# EAGLE design Main_v3 (EAGLE 9.5.2)
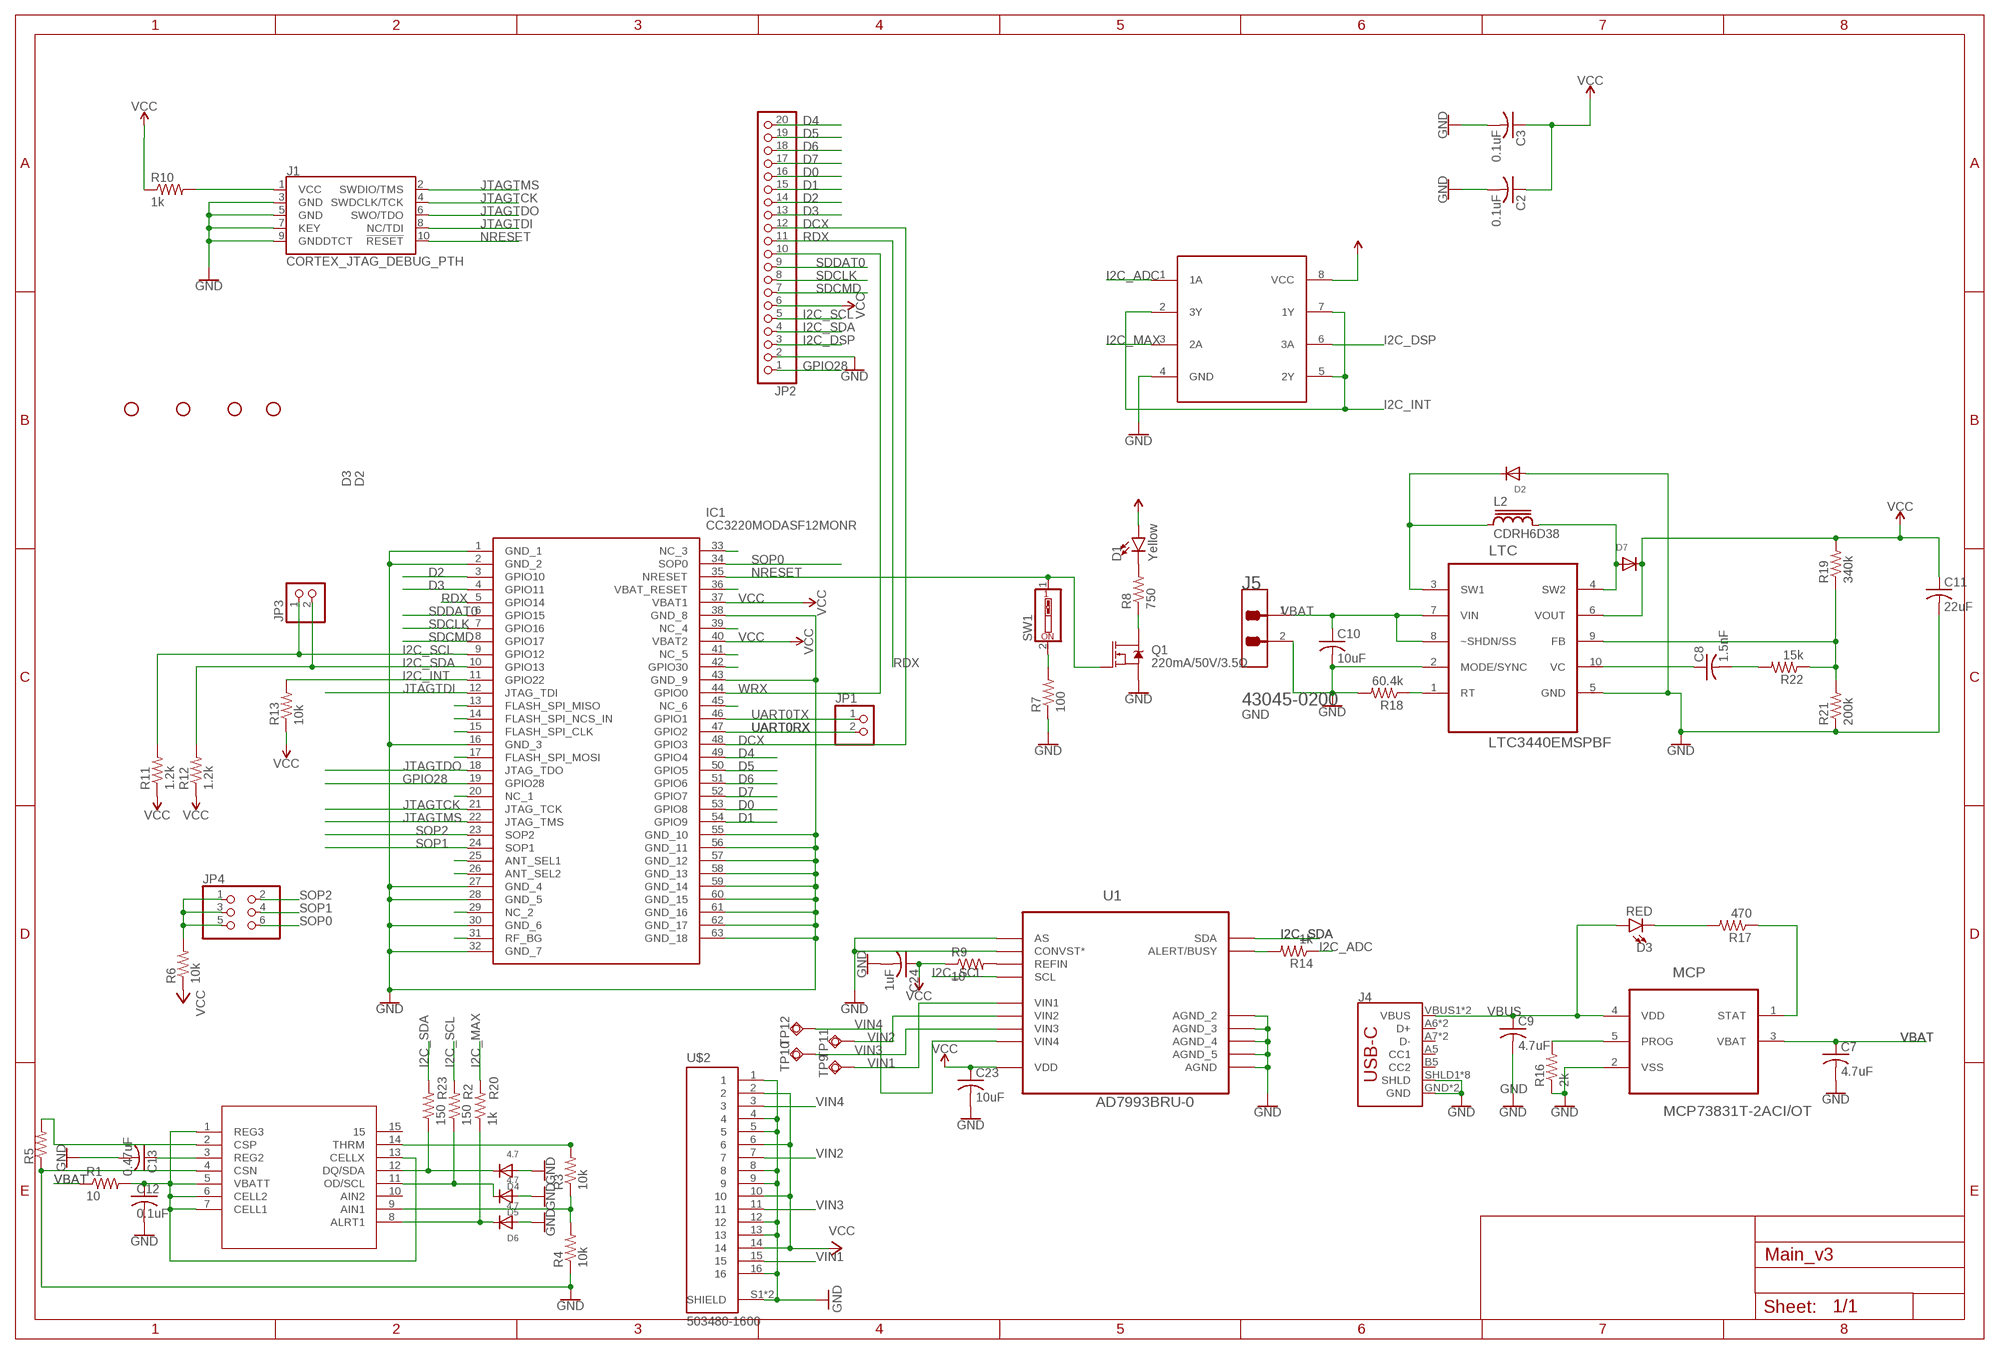
[diagram p0: schematic, sheet 1]

## Parts
74LVC  SOP65P400X110-8N  [SOP65P400X110-8N]
C2  0.1uF  C-USC0805  [C0805]
C3  0.1uF  C-USC0805  [C0805]
C7  4.7uF  C-USC0805  [C0805]
C8  1.5nF  C-USC0805  [C0805]
C9  4.7uF  C-USC0805  [C0805]
C10  10uF  C-USC0805  [C0805]
C11  22uF  C-USC1210  [C1210]
C12  0.1uF  C-USC0805  [C0805]
C13  0.47uF  C-USC0805  [C0805]
C23  10uF  C-USC0805  [C0805]
C24  1uF  C-USC0805  [C0805]
D1  Yellow  LED-YELLOW0603  [LED-0603]
D2  DIODESOD-323F  [SOD-323F]
D3  RED  LED-RED0603  [LED-0603]
D4  4.7  DIODESOD-323F  [SOD-323F]
D5  4.7  DIODESOD-323F  [SOD-323F]
D6  4.7  DIODESOD-323F  [SOD-323F]
D7  DIODESOD-323F  [SOD-323F]
H1  STAND-OFF  [STAND-OFF]
H2  STAND-OFF  [STAND-OFF]
H3  STAND-OFF  [STAND-OFF]
H4  STAND-OFF  [STAND-OFF]
IC1  CC3220MODASF12MONR  [CC3220MODASM2MONR]
J1  CORTEX_JTAG_DEBUG_PTH  [2X5-PTH-1.27MM]
J4  USB_C2-LAYER  [USB-C-16P]
J5  MOLEX_43045-0200MOLEX_43045-0200_0_0  [MOLEX_43045-0200_0]
JP1  PINHD-1X2  [1X02]
JP2  PINHD-1X20  [1X20]
JP3  PINHD-1X2  [1X02]
JP4  PINHD-2X3  [2X03]
L2  CDRH6D38  [CDRH6D]
LTC  LTC3440EMSPBF  [SOP50P490X110-10N]
MAX  MAX17201G+T  [21-0137I_T1433-1]
MCP  MCP73831T-2ACI/OT  [SOT95P280X145-5N]
Q1  220mA/50V/3.5Ω  MOSFET-NCH-BSS138  [SOT23-3]
R1  10  R-US_R0805  [R0805]
R2  150  R-US_R0805  [R0805]
R3  10k  R-US_R0805  [R0805]
R4  10k  R-US_R0805  [R0805]
R5  R-US_R0805  [R0805]
R6  10k  R-US_R0805  [R0805]
R7  100  R-US_R0805  [R0805]
R8  750  R-US_R0805  [R0805]
R9  10  R-US_R0805  [R0805]
R10  1k  R-US_R0805  [R0805]
R11  1.2k  R-US_R0805  [R0805]
R12  1.2k  R-US_R0805  [R0805]
R13  10k  R-US_R0805  [R0805]
R14  1k  R-US_R0805  [R0805]
R16  2k  R-US_R0805  [R0805]
R17  470  R-US_R0805  [R0805]
R18  60.4k  R-US_R0805  [R0805]
R19  340k  R-US_R0805  [R0805]
R20  1k  R-US_R0805  [R0805]
R21  200k  R-US_R0805  [R0805]
R22  15k  R-US_R0805  [R0805]
R23  150  R-US_R0805  [R0805]
SW1  SW_DIP-1  [EDG-01]
TP9  TPSQTP12R  [TP12R]
TP10  TPSQTP12R  [TP12R]
TP11  TPSQTP12R  [TP12R]
TP12  TPSQTP12R  [TP12R]
U1  AD7993BRU-0  [SOP65P640X120-16N]
U$2  503480-1600  [MOLEX_503480-1600]

## Nets
D0: IC1.53(GPIO8) JP2.16
D1: IC1.54(GPIO9) JP2.15
D2: IC1.3(GPIO10) JP2.14
D3: IC1.4(GPIO11) JP2.13
D4: IC1.49(GPIO4) JP2.20
D5: IC1.50(GPIO5) JP2.19
D6: IC1.51(GPIO6) JP2.18
D7: IC1.52(GPIO7) JP2.17
DCX: IC1.48(GPIO3) JP2.12
GND: 74LVC.4(GND) C2.2 C3.2 C7.2 C9.2 C10.2 C11.2 C12.2 C13.2 C23.2 C24.2 D2.A D4.A D5.A D6.A IC1.1(GND_1) IC1.2(GND_2) IC1.16(GND_3) IC1.27(GND_4) IC1.28(GND_5) IC1.30(GND_6) IC1.32(GND_7) IC1.38(GND_8) IC1.43(GND_9) IC1.55(GND_10) IC1.56(GND_11) IC1.57(GND_12) IC1.58(GND_13) IC1.59(GND_14) IC1.60(GND_15) IC1.61(GND_16) IC1.62(GND_17) IC1.63(GND_18) J1.3(GND) J1.5(GND) J1.7(KEY) J1.9(GNDDTCT) J4.GND J4.GND2(GND) J4.SHLD1(SHLD) J4.SHLD2(SHLD) J4.SHLD3(SHLD) J4.SHLD4(SHLD) J4.SHLD5(SHLD) J4.SHLD6(SHLD) J4.SHLD7(SHLD) J4.SHLD8(SHLD) J5.2 JP2.2 LTC.2(MODE/SYNC) LTC.5(GND) MAX.4(CSN) MCP.2(VSS) Q1.2(S) R4.1 R5.1 R7.1 R16.1 R18.2 R21.1 U1.1(AGND_2) U1.2(AGND_3) U1.3(AGND_4) U1.4(AGND_5) U1.11(AS) U1.12(CONVST*) U1.16(AGND) U$2.1 U$2.4 U$2.5 U$2.8 U$2.9 U$2.12 U$2.13 U$2.16 U$2.S1(SHIELD) U$2.S2(SHIELD)
GPIO28: IC1.19(GPIO28) JP2.1
I2C_ADC: 74LVC.1(1A) R14.1
I2C_DSP: 74LVC.6(3A) JP2.3
I2C_INT: 74LVC.2(3Y) 74LVC.5(2Y) 74LVC.7(1Y) IC1.11(GPIO22) R13.2
I2C_MAX: 74LVC.3(2A) R20.2
I2C_SCL: IC1.9(GPIO12) JP2.5 JP3.1 R2.2 R11.2 U1.15(SCL)
I2C_SDA: IC1.10(GPIO13) JP2.4 JP3.2 R12.2 R23.2 U1.14(SDA)
JTAG_R: J1.1(VCC) R10.2
JTAGTCK: IC1.21(JTAG_TCK) J1.4(SWDCLK/TCK)
JTAGTDI: IC1.12(JTAG_TDI) J1.8(NC/TDI)
JTAGTDO: IC1.18(JTAG_TDO) J1.6(SWO/TDO)
JTAGTMS: IC1.22(JTAG_TMS) J1.2(SWDIO/TMS)
LTC_CRS: C8.2 R22.2
LTC_FB: LTC.9(FB) R19.1 R21.2 R22.1
LTC_IND1: D2.C L2.1 LTC.3(SW1)
LTC_IND2: D7.A L2.2 LTC.4(SW2)
LTC_RT: LTC.1(RT) R18.1
LTC_VC: C8.1 LTC.10(VC)
MAX_AIN1: MAX.9(AIN1) R3.1 R4.2
MAX_CSP: MAX.2(CSP) R5.2
MAX_INT: D6.C MAX.8(ALRT1) R20.1
MAX_REG2: C13.1 MAX.3(REG2)
MAX_SCL: D5.C MAX.11(OD/SCL) R2.1
MAX_SDA: D4.C MAX.12(DQ/SDA) R23.1
MAX_THRM: MAX.14(THRM) R3.2
MAX_VBAT: C12.1 MAX.1(REG3) MAX.5(VBATT) MAX.6(CELL2) MAX.7(CELL1) MAX.13(CELLX) R1.2
MPC_LED: D3.C R17.2
MPC_RPROG: MCP.5(PROG) R16.2
MPC_STAT: MCP.1(STAT) R17.1
N$1: JP4.1 JP4.3 JP4.5 R6.2
N$2: R9.2 U1.6(REFIN)
N$3: IC1.41(NC_5)
N$4: R14.2 U1.13(ALERT/BUSY)
N$5: IC1.42(GPIO30)
N$6: IC1.39(NC_4)
N$7: IC1.36(VBAT_RESET)
N$8: IC1.33(NC_3)
N$9: IC1.45(NC_6)
N$10: IC1.25(ANT_SEL1)
N$11: IC1.26(ANT_SEL2)
N$12: IC1.29(NC_2)
N$13: IC1.31(RF_BG)
N$14: IC1.17(FLASH_SPI_MOSI)
N$15: IC1.15(FLASH_SPI_CLK)
N$16: IC1.14(FLASH_SPI_NCS_IN)
N$17: IC1.13(FLASH_SPI_MISO)
N$18: IC1.20(NC_1)
NRESET: IC1.35(NRESET) J1.10(!RESET) Q1.1(G) SW1.1
RDX: IC1.5(GPIO14) JP2.11
RESET_DIODE: D1.C R8.2
RESET_MOS: Q1.3(D) R8.1
RESET_SW1: R7.2 SW1.2
SDCLK: IC1.7(GPIO16) JP2.8
SDCMD: IC1.8(GPIO17) JP2.7
SDDAT0: IC1.6(GPIO15) JP2.9
SOP0: IC1.34(SOP0) JP4.6
SOP1: IC1.24(SOP1) JP4.4
SOP2: IC1.23(SOP2) JP4.2
UART0RX: IC1.47(GPIO2) JP1.2
UART0TX: IC1.46(GPIO1) JP1.1
VBAT: C7.1 C10.1 J5.1 LTC.7(VIN) LTC.8(~SHDN/SS) MCP.3(VBAT) R1.1
VBUS: C9.1 D3.A J4.VBUS1(VBUS) J4.VBUS2(VBUS) MCP.4(VDD)
VCC: 74LVC.8(VCC) C2.1 C3.1 C11.1 C23.1 C24.1 D1.A D7.C IC1.37(VBAT1) IC1.40(VBAT2) JP2.6 LTC.6(VOUT) R6.1 R9.1 R10.1 R11.1 R12.1 R13.1 R19.2 U1.5(VDD) U$2.2 U$2.6 U$2.10 U$2.14
VIN1: TP9.TP U1.7(VIN1) U$2.15
VIN2: TP11.TP U1.10(VIN2) U$2.7
VIN3: TP10.TP U1.8(VIN3) U$2.11
VIN4: TP12.TP U1.9(VIN4) U$2.3
WRX: IC1.44(GPIO0) JP2.10
Unconnected: J4.A5(CC1) J4.A6(D+) J4.A7(D-) J4.B5(CC2) J4.B6(D+) J4.B7(D-) MAX.10(AIN2) MAX.15

## Library data of the parts
74LVC = SOP65P400X110-8N:SOP65P400X110-8N
C2 C3 = rcl:C-US: CAPACITOR, American symbol; SPICEPREFIX: C
C7-C13 C23 C24 = adafruit:C-US: CAPACITOR, American symbol
D1 = SparkFun-LED:LED-YELLOW: Yellow SMD LED Used in manufacturing several products at SparkFun. Packages: 0603 - SMD 0603 package[Product Link] <http://www.kingbrightusa.com/product.asp?catalog_name=LED&product_id=APT1608SYCK> 0603 -SMART - SMART SMD 0603 package (more efficient/more expensive) [Product Link] <http://www.osram-os.com/osram_os/en/products/product-catalog/led-light-emitting-diodes/smartled-0603/ly-l29k/index.jsp> LilyPad - SMD1206 package[Product Datasheet] <https://www.sparkfun.com/datasheets/DevTools/LilyPad/Q150YUS4.pdf> SparkFun Products: Blynk Board <https://www.sparkfun.com/products/13794> IOIO-OTG <https://www.sparkfun.com/products/13613> XBee Explorer Serial <https://www.sparkfun.com/products/13225>; PROD_ID: DIO-09003
D2 D4-D7 = adafruit:DIODE: Diode SMADIODE - SMA Surface Mount Package 20V 1A Schottky Diode Digikey: 641-1014-6-ND DO-1N4148 - Through Hole Small Current Diode SOD-123 20V 1 A (.5mV Vf) Schottky Diode - Digikey: MBRX120TPMSCT-ND SOD-323 10V 570mA (.38mV Vf, 3ns) Schottky Diode - Digikey: ZLLS410CT-ND SOD-523 30V 30mA Schottky Diode (RB751S-40TE61) - Digikey: RB751S-40TE61CT-ND SOT23-R/W - SOT23 Package (R = Solder Paste/Reflow Ovens, W = Hand-Soldering) BAT54Film 40V 300mA - Digikey: 497-7162-1-ND
D3 = SparkFun-LED:LED-RED: Red SMD LED Used in manufacturing of most products at SparkFun Packages: 0603 - SMD 0603 package [Product Link] <http://docs.avagotech.com/docs/AV02-0551EN> 0603 SMART - SMD 0603 SMART package ( more efficient and expensive)[Product Link] <http://www.osram-os.com/Graphics/XPic2/00077099_0.pdf> 1206 - SMD1206 package [Product Link] <https://www.sparkfun.com/datasheets/DevTools/LilyPad/Q150OVS4.pdff> SparkFun Products: Pro Mini 328 -5V <https://www.sparkfun.com/products/821> RedBoard <https://www.sparkfun.com/products/12757> IOIO-OTG <https://www.sparkfun.com/products/13613>; PROD_ID: DIO-00819
H1-H4 = SparkFun-Hardware:STAND-OFF: Stand Off Drill holes for mechanically mounting via screws, standoffs, etc. Note: Use the keepout ring to avoid running the screw head into surrounding components. Variant Overviews STAND-OFF - Mechanical footprint for a #4 phillips button head screw. STAND-OFF-TIGHT - Mechanical footprint for a #4 phillips button head screw, Example SparkFun Products Screw - Phillips Head (1/4", 4-40, 10 pack) (PRT-10453) Screw - Phillips Head (1/2", 4-40, 10 pack) (PRT-10452) Screw - Phillips Head (3/4", 4-40, 10 pack) (PRT-10451) Screw - Phillips Head (1", 4-40, 10 pack) (PRT-10450)
IC1 = CC3220MODASF12MONR:CC3220MODASF12MONR: SimpleLink Wi-Fi CERTIFIED Wireless Module Solutions With Antenna Source: Datasheet; DESCRIPTION: SimpleLink Wi-Fi CERTIFIED Wireless Module Solutions With Antenna; HEIGHT: mm; MANUFACTURER_NAME: Texas Instruments; MANUFACTURER_PART_NUMBER: CC3220MODASF12MONR; MOUSER_PART_NUMBER: 595-3220MODASF12MONR; MOUSER_PRICE-STOCK: https://www.mouser.com/Search/Refine.aspx?Keyword=595-3220MODASF12MONR
J1 = SparkFun-Connectors:CORTEX_JTAG_DEBUG: Cortex Debug Connector - 10 pin Supports JTAG debug, Serial Wire debug, and Serial Wire Viewer. PTH and SMD connector options available. General Connector Information <http://infocenter.arm.com/help/topic/com.arm.doc.faqs/attached/13634/cortex_debug_connectors.pdf> Products: PTH Connector <http://www.digikey.com/product-detail/en/cnc-tech/3220-10-0100-00/1175-1627-ND/3883661> -via Digi-Key SparkFun PSoc <https://www.sparkfun.com/products/13229> SparkFun T <https://www.sparkfun.com/products/13810>
J4 = SparkFun-Connectors:USB_C: USB Type C 16Pin Connector Super Speed pins not available on the 16-pin purely SMD connector so this part is best for USB 2.0 implementations. D1 and D2 are tied together enabling D+/- no matter which way the cable is plugged into the connector. The two channel configuration pins (CC1/2) are exposed. These are normally connected to ground via 5.1k resistors but can be reconfigured for high current/high power applications.; PROD_ID: CONN-14122
J5 = Molex - 43045-0200:MOLEX_43045-0200: Wire-To-Board Connector, Micro-Fit 3.0, 43045 Series, Through Hole, Header, 2 Contacts, 3 mm; CENTROID_NOT_SPECIFIED: No; CONN_GENDER: Male; CONN_ORIENTATION: Right Angle; CONTACT_MATERIAL: Tin; CURRENT_RATING: 8.5A; DATASHEET: http://www.molex.com/webdocs/datasheets/pdf/en-us//0430450200_PCB_HEADERS.pdf; DEVICE_CLASS_L1: Connectors; DEVICE_CLASS_L2: Board to Board Connectors; DEVICE_CLASS_L3: unset; DIGIKEY_DESCRIPTION: CONN HEADER 2POS 3MM RT ANG TIN; DIGIKEY_PART_NUMBER: WM1813-ND; FOOTPRINT_URL: http://www.molex.com/pdm_docs/sd/430450200_sd.pdf; HEIGHT: 9.27mm; LEAD_FREE: yes; MF: Molex; MFG_PACKAGE_IDENT: 43045-0200; MFG_PACKAGE_IDENT_DATE: 0; MFG_PACKAGE_IDENT_REV: 0; MOUSER_DESCRIPTION: Header; Micro-Fit 3.0; SMC; 2-Row; Rt Angle; Peg Lock; 2 Cir; Tin Plate; Glow Wire Comp.; MOUSER_PART_NUMBER: 538-43045-0200; MPN: 43045-0200; NUMBER_OF_CONTACTS: 2; NUMBER_OF_ROWS: 2; PACKAGE: HDR2; PREFIX: J; ROHS: yes; TEMPERATURE_RANGE_HIGH: +105°C; TEMPERATURE_RANGE_LOW: -40°C; VERIFICATION_VERSION: 0.0.0.1; VOLTAGE_RATING: 600V
JP1 JP3 = pinhead:PINHD-1X2: PIN HEADER
JP2 = adafruit:PINHD-1X20: PIN HEADER
JP4 = pinhead:PINHD-2X3: PIN HEADER
L2 = CDRH6D38:CDRH6D38: Power Inductor; AVAILABILITY: Unavailable; DESCRIPTION: 10µH Shielded Inductor 2A 38mOhm Max Nonstandard; MF: Sumida America; MP: CDRH6D38; PACKAGE: None; PRICE: None
LTC = LTC3440EMSPBF:LTC3440EMSPBF: Micropower Synchronous Buck-Boost DC/DC Converter; AVAILABILITY: Unavailable; DESCRIPTION: Conv DC-DC 2.5V to 5.5V Synchronous Non-Inverting/Inverting/Step Up/Step Down Single-Out 2.5V to 5.5; MF: Analog Devices; MP: LTC3440EMS#PBF; PACKAGE: MSOP-10 Analog Devices; PRICE: None
MAX = AD7993BRU-0:MAX17201G+T; BUILT_BY: UL_Team_Molly; COPYRIGHT: Copyright (C) 2018 Accelerated Designs. All rights reserved; MANUFACTURER_PART_NUMBER: MAX17201G+T; VENDOR: Maxim Integrated Products
MCP = MCP73831T-2ACI_OT:MCP73831T-2ACI/OT: Charge Management Controller; DESCRIPTION: Charger IC Lithium Ion/Polymer SOT-23-5; DIGI-KEY_PART_NUMBER: MCP73831T-2ACI/OTCT-ND; DIGI-KEY_PURCHASE_URL: https://www.digikey.com/product-detail/en/microchip-technology/MCP73831T-2ACI-OT/MCP73831T-2ACI-OTCT-ND/1979802?utm_source=snapeda&utm_medium=aggregator&utm_campaign=symbol; MF: Microchip; MP: MCP73831T-2ACI/OT; PACKAGE: SOT-23 Microchip
Q1 = SparkFun-DiscreteSemi:MOSFET-NCH: N-channel MOSFETs Voltage controlled devices that allow control of high current outputs. SparkFun Products: SparkFun OpenScale <https://www.sparkfun.com/products/13261> SparkFun Digital Sandbox <https://www.sparkfun.com/products/12651> SparkFun Monster Moto Shield <https://www.sparkfun.com/products/10182> SparkFun MOSFET Power Controller <https://www.sparkfun.com/products/11214>; PROD_ID: TRANS-00830
R1-R5 R7 R8 R10-R12 R16-R23 = adafruit:R-US_: RESISTOR, American symbol
R6 R9 R13 R14 = rcl:R-US_: RESISTOR, American symbol; SPICEPREFIX: R
SW1 = special:SW_DIP-1: DIP SWITCH
TP9-TP12 = testpad:TPSQ: Test pad
U1 = AD7993BRU-0:AD7993BRU-0: 10BIT ADC, 4CH I2C I/F, SMD; AVAILABILITY: Unavailable; DESCRIPTION: 10 Bit Analog to Digital Converter 4 Input 1 SAR 16-TSSOP; MF: Analog Devices; MP: AD7993BRU-0; PACKAGE: TSSOP-16 Analog; PRICE: None
U$2 = 503480-0400:503480-1600

## Board
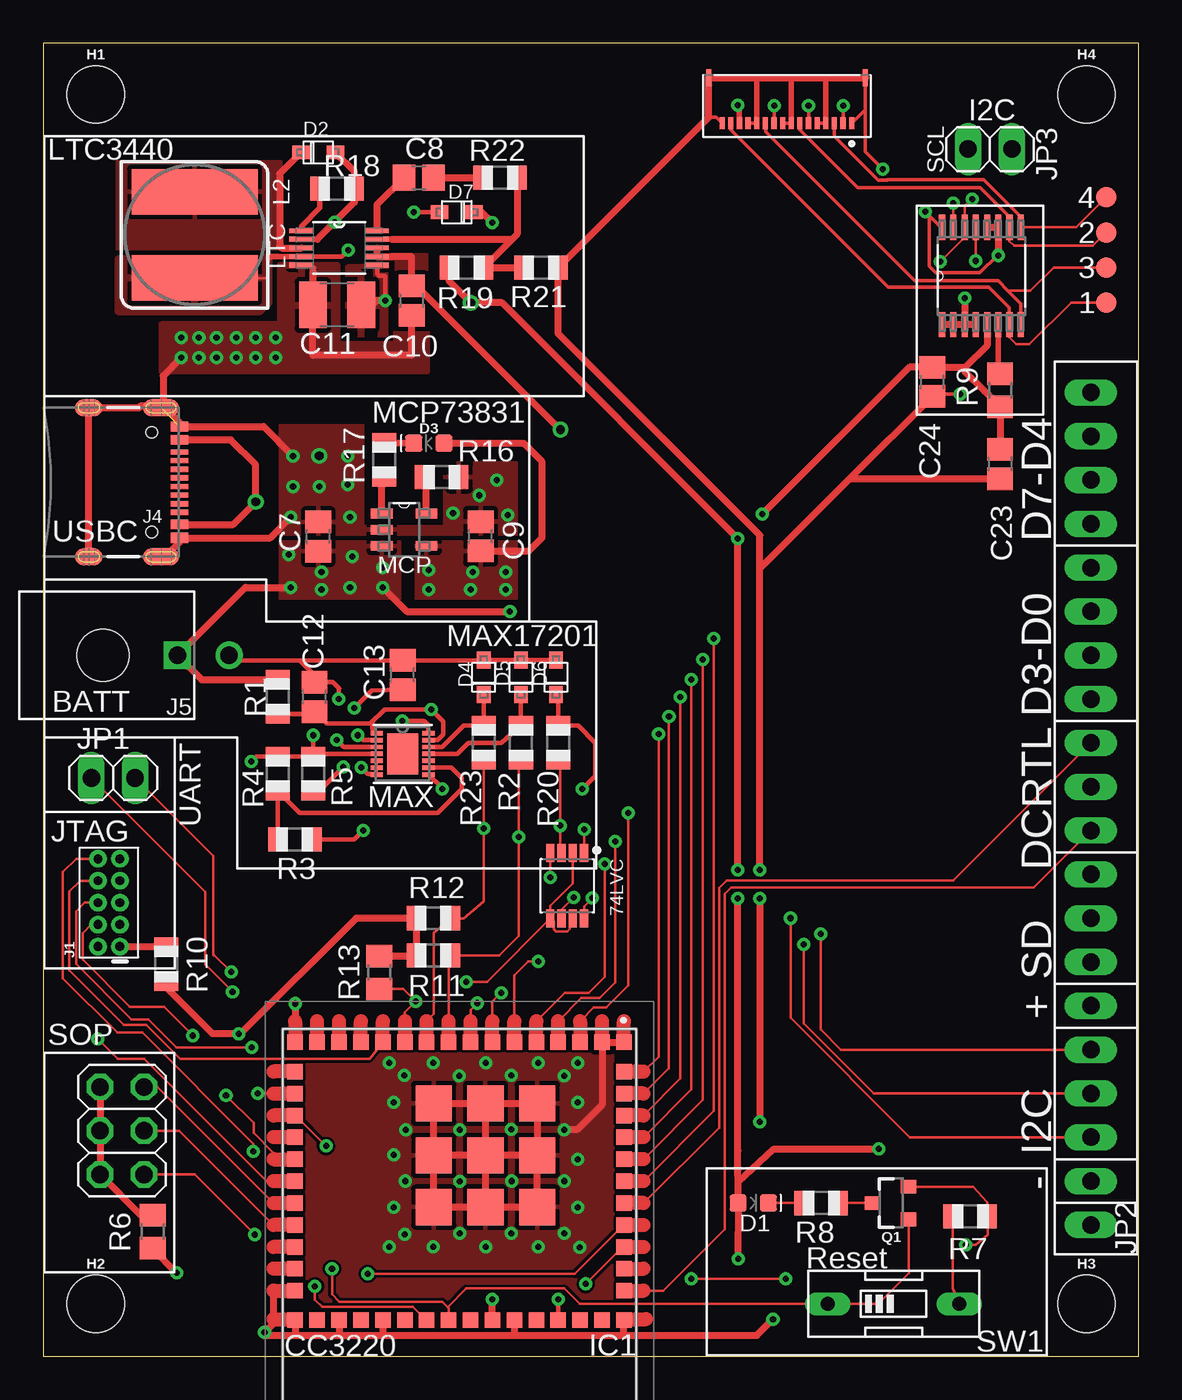
[diagram p1: board, top side]
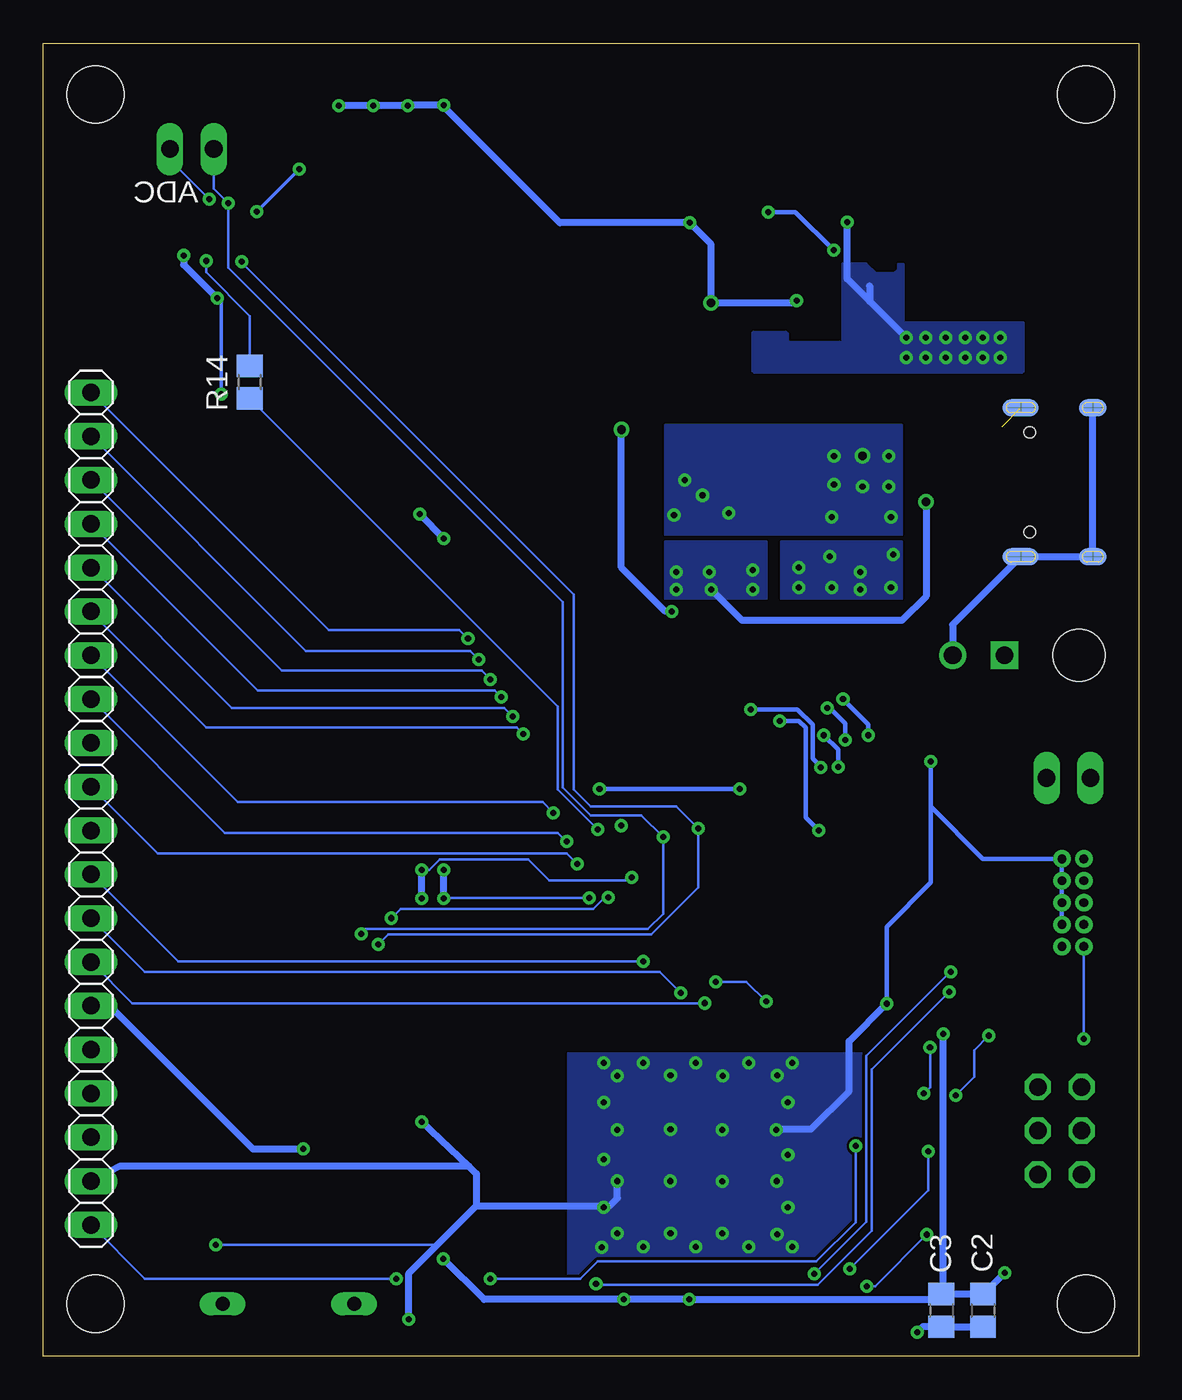
[diagram p2: board, bottom side, seen from below]

Size 63.48 x 76.12 mm. Coordinates in mm from the lower left corner, seen from the top.
Outline: 0,0 63.48,0 63.48,76.12 0,76.12 0,0
Copper layers (1*16): Top 0.035mm / dielectric 1.5mm / Bottom 0.035mm
Design rules "default *": minimum track width 6mil, minimum drill 0.35mm, track to track 6mil, track to pad 6mil, pad to pad 6mil, via to via 6mil, smd to smd 6mil, copper to edge 40mil, drill to drill 6mil, minimum pad ring 10mil, minimum via ring 8mil, stop-mask expansion 4mil, vias tented up to drill 14mil, thermal gap 10mil

### Footprints (pad centres in the part's own frame; a part is rotated, then mirrored left to right if it is on the bottom)
SOP65P400X110-8N = smd 1.046 x 0.475: 1 -1.892,0.975; 2 -1.892,0.325; 3 -1.892,-0.325; 4 -1.892,-0.975; 5 1.892,-0.975; 6 1.892,-0.325; 7 1.892,0.325; 8 1.892,0.975
C0805 = smd 1.3 x 1.5: 1 -0.95,0; 2 0.95,0
C0805' = smd 1.3 x 1.5: 1 -0.85,0; 2 0.85,0
C1210 = smd 1.6 x 2.7: 1 -1.4,0; 2 1.4,0
LED-0603 = smd 1 x 1: A -0.877,0; C 0.877,0
SOD-323F = smd 1 x 0.8: A -1,0; C 1,0
STAND-OFF = hole 3.302: 0,0
CC3220MODASM2MONR = smd 0.9 x 0.9: 1 -8.05,9.525; 2 -8.05,8.255; 3 -8.05,6.985; 4 -8.05,5.715; 5 -8.05,4.445; 6 -8.05,3.175; 7 -8.05,1.905; 8 -8.05,0.635; 9 -8.05,-0.635; 10 -8.05,-1.905; 11 -8.05,-3.175; 12 -8.05,-4.445; 13 -8.05,-5.715; 14 -8.05,-6.985; 15 -8.05,-8.255; 16 -8.05,-9.525; 17 -6.35,-9.525; 18 -5.08,-9.525; 19 -3.81,-9.525; 20 -2.54,-9.525; 21 -1.27,-9.525; 22 0,-9.525; 23 1.27,-9.525; 24 2.54,-9.525; 25 3.81,-9.525; 26 5.08,-9.525; 27 6.35,-9.525; 28 8.05,-9.525; 29 8.05,-8.255; 30 8.05,-6.985; 31 8.05,-5.715; 32 8.05,-4.445; 33 8.05,-3.175; 34 8.05,-1.905; 35 8.05,-0.635; 36 8.05,0.635; 37 8.05,1.905; 38 8.05,3.175; 39 8.05,4.445; 40 8.05,5.715; 41 8.05,6.985; 42 8.05,8.255; 43 8.05,9.525; 44 6.35,9.525; 45 5.08,9.525; 46 3.81,9.525; 47 2.54,9.525; 48 1.27,9.525; 49 0,9.525; 50 -1.27,9.525; 51 -2.54,9.525; 52 -3.81,9.525; 53 -5.08,9.525; 54 -6.35,9.525 | smd 2.1 x 2.1: 55 -4.5,4.5; 56 -4.5,1.5; 57 -4.5,-1.5; 58 -1.5,4.5; 59 -1.5,1.5; 60 -1.5,-1.5; 61 1.5,4.5; 62 1.5,1.5; 63 1.5,-1.5
2X5-PTH-1.27MM = drill 0.508 pad 1: 1 -2.54,-0.635; 2 -2.54,0.635; 3 -1.27,-0.635; 4 -1.27,0.635; 5 0,-0.635; 6 0,0.635; 7 1.27,-0.635; 8 1.27,0.635; 9 2.54,-0.635; 10 2.54,0.635
USB-C-16P = smd 0.3 x 1.016: A5 -1.25,0.154; A6 -0.25,0.154; A7 0.25,0.154; A8 1.25,0.154; B5 1.75,0.154; B6 0.75,0.154; B7 -0.75,0.154; B8 -1.75,0.154 | smd 0.6 x 1.016: GND -3.225,0.154; GND2 3.225,0.154 | smd 1 x 2.1: SHLD1 -4.32,-0.915; SHLD2 4.32,-0.915 | smd 1 x 2.1 bottom: SHLD3 -4.32,-0.915; SHLD4 4.32,-0.915 | smd 1 x 1.6: SHLD5 -4.32,-5.095; SHLD8 4.32,-5.095 | smd 1 x 1.6 bottom: SHLD6 -4.32,-5.095; SHLD7 4.32,-5.095 | smd 0.55 x 1.016: VBUS1 -2.45,0.154; VBUS2 2.45,0.154 | hole 0.65: -2.89,-1.445; 2.89,-1.445
MOLEX_43045-0200_0 = drill 1.02 pad 1.57 square: 1 0,3.965 | drill 1.02 pad 1.57: 2 0,6.965 | hole 3: 0,-0.355
1X02 = drill 1.016 long: 1 -1.27,0; 2 1.27,0
1X20 = drill 1.016 long: 1 -24.13,0; 2 -21.59,0; 3 -19.05,0; 4 -16.51,0; 5 -13.97,0; 6 -11.43,0; 7 -8.89,0; 8 -6.35,0; 9 -3.81,0; 10 -1.27,0; 11 1.27,0; 12 3.81,0; 13 6.35,0; 14 8.89,0; 15 11.43,0; 16 13.97,0; 17 16.51,0; 18 19.05,0; 19 21.59,0; 20 24.13,0
2X03 = drill 1.016 octagon: 1 -2.54,-1.27; 2 -2.54,1.27; 3 0,-1.27; 4 0,1.27; 5 2.54,-1.27; 6 2.54,1.27
CDRH6D = smd 7.3 x 2.65: 1 0,2.493; 2 0,-2.493
SOP50P490X110-10N = smd 1.397 x 0.279: 1 -2.184,0.991; 2 -2.184,0.508; 3 -2.184,0; 4 -2.184,-0.508; 5 -2.184,-0.991; 6 2.184,-0.991; 7 2.184,-0.508; 8 2.184,0; 9 2.184,0.508; 10 2.184,0.991
21-0137I_T1433-1 = smd 0.711 x 0.254: 1 -1.499,1.2; 2 -1.499,0.8; 3 -1.499,0.4; 4 -1.499,0; 5 -1.499,-0.4; 6 -1.499,-0.8; 7 -1.499,-1.2; 8 1.499,-1.2; 9 1.499,-0.8; 10 1.499,-0.4; 11 1.499,0; 12 1.499,0.4; 13 1.499,0.8; 14 1.499,1.2 | smd 1.803 x 2.388: 15 0,0
SOT95P280X145-5N = smd 1.27 x 0.559: 1 -1.295,0.94; 2 -1.295,0; 3 -1.295,-0.94; 4 1.295,-0.94; 5 1.295,0.94
SOT23-3 = smd 0.8 x 0.9: 1 -0.95,-1; 2 0.95,-1; 3 0,1.1
R0805 = smd 1.1 x 1.4: 1 -1,0; 2 1,0
R0805' = smd 1.3 x 1.5: 1 -0.95,0; 2 0.95,0
EDG-01 = drill 0.813 long: 1 0,-3.81; 2 0,3.81
TP12R = smd 1.2 x 1.2: TP 0,0
SOP65P640X120-16N = smd 1.473 x 0.356: 1 -2.819,2.286; 2 -2.819,1.626; 3 -2.819,0.965; 4 -2.819,0.33; 5 -2.819,-0.33; 6 -2.819,-0.965; 7 -2.819,-1.626; 8 -2.819,-2.286; 9 2.819,-2.286; 10 2.819,-1.626; 11 2.819,-0.965; 12 2.819,-0.33; 13 2.819,0.33; 14 2.819,0.965; 15 2.819,1.626; 16 2.819,2.286
MOLEX_503480-1600 = smd 0.3 x 0.7: 1 -0.75,1.325; 2 -0.25,1.325; 3 0.251,1.325; 4 0.751,1.325; 5 1.251,1.325; 6 1.752,1.325; 7 2.252,1.325; 8 2.752,1.325; 9 3.252,1.325; 10 3.752,1.325; 11 4.252,1.325; 12 4.753,1.325; 13 5.253,1.325; 14 5.753,1.325; 15 6.251,1.325; 16 6.751,1.325 | smd 0.3 x 1: S1 -1.54,-1.325; S2 7.541,-1.325

### Placement (x,y rotation side)
74LVC  30.37,27.28 270 top
C2  9.02,2.67 270 bottom
C3  11.43,2.67 270 bottom
C7  4.7uF  [C0805']  15.94,47.52 90 top
C8  1.5nF  [C0805']  21.77,68.33 0 top
C9  4.7uF  [C0805']  25.35,47.54 90 top
C10  10uF  [C0805']  21.35,61.2 270 top
C11  17.03,60.95 180 top
C12  0.1uF  [C0805']  15.72,38.23 90 top
C13  0.47uF  [C0805']  20.83,39.5 90 top
C23  10uF  [C0805']  55.45,51.73 270 top
C24  1uF  [C0805']  51.51,56.49 270 top
D1  41.15,8.89 0 top
D2  15.94,69.79 180 top
D3  22.35,52.93 180 top
D4  25.53,39.37 270 top
D5  27.69,39.37 270 top
D6  29.72,39.37 270 top
D7  23.96,66.32 0 top
H1  3.05,73.15 0 top
H2  3.05,3.05 0 top
H3  60.45,3.05 0 top
H4  60.45,73.15 0 top
IC1  24.13,10.16 270 top
J1  3.81,26.3 90 top
J4  7.75,50.67 270 top
J5  3.81,40.64 270 top
JP1  4.06,33.53 0 top
JP2  60.71,31.75 90 bottom
JP3  54.86,69.98 0 top
JP4  4.57,13.08 270 top
L2  8.78,65.01 0 top
LTC  17.16,64.25 0 top
MAX  20.83,34.92 0 top
MCP  20.92,47.92 0 top
Q1  49.15,8.89 90 top
R1  13.59,38.23 270 top
R2  27.69,35.56 270 top
R3  14.58,29.97 0 top
R4  13.59,33.78 270 top
R5  15.66,33.78 270 top
R6  10k  [R0805']  6.35,7.24 90 top
R7  53.72,8.13 180 top
R8  45.09,8.89 180 top
R9  10  [R0805']  55.45,55.99 90 top
R10  7.14,22.75 90 top
R11  22.61,23.24 0 top
R12  22.61,25.4 0 top
R13  10k  [R0805']  19.48,22.25 270 top
R14  1k  [R0805']  51.51,56.48 90 bottom
R16  23.09,50.98 180 top
R17  19.76,51.98 90 top
R18  17.03,67.68 0 top
R19  24.52,63.11 180 top
R20  29.84,35.56 270 top
R21  28.84,63.11 180 top
R22  26.47,68.33 180 top
R23  25.53,35.56 270 top
SW1  49.28,3.05 270 top
TP9  61.59,61.09 270 top
TP10  61.59,63.12 270 top
TP11  61.59,65.15 90 top
TP12  61.59,67.18 90 top
U1  54.37,62.62 90 top
U$2  46.1,72.8 180 top

### Tracks (layer width: path | path; a pad name or v marks a point on that pad's centre or on a via)
D0  (via drill 0.35)
  Top 0.152: 34.8,15.24 36.27,16.71 v36.27,37.08
  Top 0.813: 34.8,15.24 IC1.53
  Bottom 0.152: v36.27,37.08 36.77,37.59 52.55,37.59 60.67,45.72 JP2.16
D1  (via drill 0.35)
  Top 0.152: v35.66,36.07 35.66,17.37 34.8,16.51
  Top 0.813: IC1.54 34.8,16.51
  Bottom 0.152: JP2.15 60.71,43.12 54.04,36.45 36.04,36.45 v35.66,36.07
D2  (via drill 0.35)
  Top 0.152: 31.11,19.43 31.9,20.22 32.64,20.22 33.91,21.49 v33.91,31.5
  Top 0.813: 31.11,19.43 IC1.3
  Bottom 0.152: JP2.14 52.2,32.13 34.54,32.13 v33.91,31.5
D3  (via drill 0.35)
  Top 0.152: 29.84,19.43 31.19,20.78 32.26,20.78 33.14,21.66 v33.14,29.84 v33.15,29.84
  Top 0.813: IC1.4 29.84,19.43
  Bottom 0.152: JP2.13 52.96,30.35 33.66,30.35 v33.15,29.84
D4  (via drill 0.35)
  Top 0.152: v38.86,41.6 38.86,14.22 34.8,10.16
  Top 0.813: 34.8,10.16 IC1.49
  Bottom 0.152: JP2.20 46.93,42.1 39.36,42.1 v38.86,41.6
D5  (via drill 0.35)
  Top 0.152: v38.23,40.39 38.23,14.86 34.8,11.43
  Top 0.813: 34.8,11.43 IC1.50
  Bottom 0.152: JP2.19 48.26,40.89 38.73,40.89 v38.23,40.39
D6  (via drill 0.35)
  Top 0.152: v37.56,39.24 37.56,15.47 34.8,12.7
  Top 0.813: 34.8,12.7 IC1.51
  Bottom 0.152: JP2.18 49.66,39.75 38.07,39.75 v37.56,39.24
D7  (via drill 0.35)
  Top 0.152: v36.93,38.23 36.93,16.1 34.8,13.97
  Top 0.813: 34.8,13.97 IC1.52
  Bottom 0.152: JP2.17 51.05,38.61 37.31,38.61 v36.93,38.23
DCX
  Top 0.152: IC1.48 33.66,8.94 | JP2.12 52.74,27.6 39.62,27.6 39.17,27.14 39.17,13.26 34.8,8.89
  Top 0.813: 34.8,8.89 IC1.48
GND  (via drill 0.35, 0.5)  (3 unrouted)
  Top 0.152: v53.47,6.48 54.04,6.48 54.75,7.04 R7.1 54.72,8.93 53.89,9.84 Q1.2 | LTC.5 15.43,63.26 15.63,63.06 | v29.38,27.75 29.39,27.77 74LVC.4
  Top 0.203: v48.64,68.82 47.64,69.82 47.64,72.26 | U1.16 52.02,65.44 v51.1,66.36 51.35,66.11 51.35,63.19 51.72,62.82 54.27,62.82 55.27,63.82 v55.33,63.82 | C24.2 51.65,55.78 v53.15,55.78 | U$2.16 39,71.83 38.56,71.83 | U$2.13 U$2.12 | U$2.9 U$2.8 | U$2.5 U$2.4 | U$2.1 47.64,72.26 | 47.64,72.26 47.64,74.09 U$2.S1
  Top 0.254: J5.2 11.07,40.35 14.86,40.35 | 14.86,40.35 C13.2 25.5,40.35 D4.A D5.A D6.A | 14.86,40.35 15.72,39.48 C12.2 16.78,39.08 17.14,38.71 17.13,38.7 v17.13,38.1 | v12.05,34.49 12.34,34.78 R4.1 R5.1 | R5.1 15.94,34.78 16.08,34.92 MAX.4 | R5.1 v15.66,36.01
  Top 0.305: LTC.2 15.89,64.76 | U$2.12 41.35,74.12 41.29,74.12 | U$2.8 43.35,74.12 43.41,74.12 | U$2.4 45.35,74.12 45.33,74.12
  Top 0.406: IC1.63 IC1.62 | IC1.62 IC1.61 IC1.58 | IC1.58 IC1.59 | IC1.59 IC1.60 | IC1.63 IC1.60 | IC1.59 IC1.62 | IC1.60 IC1.57 IC1.56 | IC1.56 IC1.55 | IC1.55 IC1.58 | IC1.56 IC1.59 | IC1.1 IC1.2 32.38,14.58 30.94,13.13 v30.2,13.13 | IC1.28 14.61,1.22 | 14.61,1.22 17.14,1.22 | 17.14,1.22 19.68,1.22 | 19.68,1.22 27.3,1.22 | 27.3,1.22 33.66,1.22 | 33.66,1.22 IC1.43 33.66,2.16 | IC1.38 27.3,1.22 | IC1.32 19.68,1.22 | IC1.30 17.14,1.22 | v42.29,2.16 41.35,1.22 33.66,1.22 | 22.86,8 22.63,8.23 IC1.63 | IC1.55 28.74,14.66 | C10.2 21.35,58.03 15.63,58.03 C11.2 15.63,63.06 | 14.61,1.22 13,1.22 v12.83,1.39 13.34,1.9 13.34,2.16 13.34,3.81 | IC1.63 | J4.SHLD7 J4.SHLD5 5.55,54.99 5.66,55.11 6.95,55.11 | U1.1 U1.2 U1.3 | U1.4 U1.3 | U1.12 U1.11 v55.33,63.82 | v53.4,61.34 U1.3 | v41.53,26.54 v41.53,13.59 | J4.GND2 7.9,47.2 7.85,47.14 | J4.GND2 7.85,47.39 7.85,47.14 | 7.85,47.14 6.94,46.24 | 6.94,46.24 6.83,46.24 J4.SHLD4 6.94,46.24 | 41.53,45.66 46.75,50.88 | C24.2 46.75,50.88 | 46.75,50.88 C23.2 | 41.53,45.66 41.53,47.6 29.84,59.29 R21.1 38.56,71.83 U$2.S2 41.29,74.12 41.33,74.12 | D2.A 18.03,68.69 R18.2 18.03,66.9 16.88,65.75 | 15.89,64.76 16.88,65.75 | 16.88,65.75 v16.89,65.75 | v8.01,57.9 6.95,56.83 6.95,55.11 | 6.95,55.11 7.9,54.15 J4.GND 12.78,53.9 v14.48,52.2 | v41.53,28.2 41.53,45.66 | J4.GND2 13.16,47.45 v14.35,48.64 | 41.33,74.12 43.41,74.12 45.33,74.12 47.61,74.12 47.64,74.09 | 41.35,74.1 41.33,74.12 | v14.61,20.45 14.61,19.43
  Top 0.813: 13.34,3.81 IC1.27 | IC1.2 32.38,19.43 | IC1.1 33.66,19.43 | 14.61,19.43 IC1.16 | 13.34,2.16 14.61,2.16 | 33.66,2.16 34.92,2.16
  Bottom 0.152: 40.64,6.48 v53.46,6.48 v53.47,6.48 | v41.53,28.2 41.12,28.2 40.51,28.81 35.37,28.81 34.14,27.58 29.54,27.58 v29.38,27.75
  Bottom 0.203: v48.64,68.82 v51.1,66.36 | v53.15,55.78 53.15,61.09 v53.4,61.34
  Bottom 0.254: J1.3 J1.5 J1.7 J1.9 9.03,28.84 12.05,31.86 v12.05,34.49 12.05,27.46 14.61,24.91 v14.61,20.45 | v15.66,36.01 15.66,36.63 v17.13,38.1
  Bottom 0.406: 38.81,11.02 38.38,10.59 38.38,8.73 | 38.81,11.02 59.03,11.02 JP2.2 | 38.81,11.02 v41.53,13.59 | C2.2 C3.2 12.5,1.72 v12.83,1.39 | v42.29,2.16 42.29,4.83 40.64,6.48 38.38,8.73 | J4.SHLD5 J4.SHLD7 J4.SHLD4 10.78,42.41 J5.2 | v55.33,63.82 55.33,63.27 v53.4,61.34 | v21.01,13.13 21.01,13.16 18.99,13.16 16.78,15.37 16.78,18.27 v14.61,20.45 | 38.38,8.73 30.64,8.73 30.2,9.17 v30.2,10.16 | 15.58,62.06 15.58,61.15 | v13.47,59.04 16.89,62.46 v16.89,65.75 | v41.53,26.54 v41.53,28.2
  other vias: 12.33,59.04 11.19,59.04 10.05,59.04 9.03,59.04 8.01,59.04 9.03,57.9 10.05,57.9 11.19,57.9 12.33,57.9 13.47,57.9 16,52.2 17.65,52.2 14.48,50.42 16,50.42 17.65,50.55 17.78,48.64 23.75,48.9 25.27,49.91 26.29,50.8 26.92,48.77 20.93,16.28 24.13,13.13 27.13,13.16 27.15,10.16 24.13,10.13 27.13,7.14 24.13,7.14 30.2,7.14 30.2,16.26 27.13,16.28 24.1,16.26 20.98,10.16 20.95,7.09 30.99,14.73 30.99,11.43 30.99,8.64 28.7,6.35 25.65,6.35 22.61,6.35 20.32,8.64 20.32,11.68 20.32,14.73 22.61,17.02 25.65,17.02 28.7,17.02 20.07,17.02 30.99,17.02 20.07,6.35 31.1,6.31
  pour Top: 14.11,59.8 6.87,59.8 6.87,57.14 14.74,57.14 14.24,59.93 14.11,59.68
  pour Top: 17.03,63.23 13.73,63.23 13.73,57.26 13.86,57.14 22.24,57.14 22.24,59.93 20.46,59.93 20.46,58.66 17.03,58.66
  pour Bottom: 6.69,59.92 6.69,57.09 6.77,57.01 22.27,57.01 22.37,57.11 22.37,59.35 22.34,59.38 20.43,59.38 20.32,59.27 20.32,58.79 17.14,58.79 17.14,63.35 15.77,63.35 15.77,63.33 15.21,62.78 14.19,62.78 13.94,63.02 13.94,63.31 13.63,63.31 13.63,59.93
  pour Top: 27.43,47.62 13.72,47.62 13.72,53.98 18.54,53.98 18.54,48.13 23.24,48.13 23.24,51.82 27.43,51.82
  pour Bottom: 13.72,53.98 27.43,53.98 27.43,47.62 13.72,47.62
  pour Top: 15.24,17.58 33.05,17.58 33.05,2.74 15.24,2.74
  pour Bottom: 15.24,17.58 33.05,17.58 33.05,2.72 15.24,2.72
GPIO28  (via drill 0.35)
  Top 0.152: IC1.19 v16.38,12.19 v16.39,12.19 | v37.57,4.5 v43.03,4.5
  Top 0.813: IC1.19 13.34,13.97
  Bottom 0.152: v16.39,12.19 16.39,7.79 18.67,5.51 31.33,5.51 32.34,4.5 v37.57,4.5 | v43.03,4.5 57.58,4.5 JP2.1
I2C_ADC  (via drill 0.35)
  Top 0.152: v31.34,30.53 74LVC.1
  Bottom 0.152: v31.34,30.53 33.66,32.85 33.66,37.68 R14.1
I2C_DSP  (via drill 0.35, 0.35 pad 0.55)
  Top 0.152: JP2.3 50.23,12.7 43.31,19.62 43.31,22.6 43.32,22.61 43.32,25.39 v43.31,25.4 | v30.73,26.59 30.04,25.9 74LVC.6
  Bottom 0.152: v30.73,26.59 30.95,26.59 31.6,25.94 42.77,25.94 v43.31,25.4
I2C_INT  (via drill 0.35)
  Top 0.152: 74LVC.5 25.72,21.72 v24.51,21.72 | 74LVC.5 29.57,25.2 29.57,24.77 29.71,24.64 30.37,24.64 30.51,24.77 30.51,25.2 74LVC.7 | 74LVC.2 30.69,27.41 29.38,26.1 74LVC.5 | R13.2 20.86,21.3 v21.59,20.57 20.95,19.94 20.95,19.43
  Top 0.813: 20.95,19.43 IC1.11
  Bottom 0.152: v24.51,21.72 22.73,21.72 v21.59,20.57
I2C_MAX  (via drill 0.35)
  Top 0.152: R20.2 29.97,34.43 v29.97,30.76 29.97,29.17 74LVC.3
I2C_SCL  (via drill 0.35)
  Top 0.152: R2.2 27.56,34.43 v27.56,30.1 27.56,24.38 26.42,23.24 R11.2 23.5,23.13 23.5,19.43 | v45.06,24.49 45.06,18.95 46.23,17.78 JP2.5 | U1.15 v52.74,66.84
  Top 0.813: IC1.9 23.5,19.43
  Bottom 0.152: JP3.1 53.59,67.69 v52.74,66.84 52.74,63.11 33.36,43.72 33.36,32.98 31.75,31.37 28.83,31.37 v27.56,30.1 27.56,25.65 28.45,24.77 44.78,24.77 v45.06,24.49
I2C_SDA  (via drill 0.35, 0.35 pad 0.55)
  Top 0.152: R23.2 v25.53,30.61 25.53,26.38 24.38,25.4 R12.2 22.64,24.54 22.64,19.84 22.23,19.43 | JP2.4 48.12,15.24 44.07,19.29 v44.07,23.88 | v53.84,67.08 53.79,67.08 53.4,66.7 U1.14 53.4,64.87 v51.99,63.45 v51.98,63.45
  Top 0.813: IC1.10 22.23,19.43
  Bottom 0.152: v53.84,67.08 56.13,69.37 JP3.2 | v51.98,63.45 51.98,63.41 32.73,44.16 32.73,32.85 31.75,31.88 26.8,31.88 v25.53,30.61 25.53,27.18 28.25,24.46 43.48,24.46 v44.07,23.88
JTAG_R
  Top 0.406: R10.2 4.46,23.75 J1.1
JTAGTCK  (via drill 0.35)
  Top 0.152: J1.4 2.79,25.03 2.29,24.52 2.29,23 5.03,20.26 7.01,20.26 v8.67,18.59 | v10.6,15.13 12.19,13.53 12.19,12.95 13.34,11.8 13.34,11.43
  Top 0.813: 13.34,11.43 IC1.21
  Bottom 0.152: v8.67,18.59 9.53,17.74 9.53,16.2 v10.6,15.13
JTAGTDI
  Top 0.152: IC1.12 18.91,17.26 7.94,17.26 5.97,19.23 4.66,19.23 1.52,22.36 1.52,26.94 2.16,27.57 J1.8
  Top 0.813: IC1.12 19.68,19.43
JTAGTDO  (via drill 0.35)
  Top 0.152: J1.6 2.41,26.3 1.91,25.79 1.91,22.75 5.12,19.53 6.09,19.53 7.72,17.91 v12.09,17.91 | v12.45,15.24 13.34,15.24
  Top 0.813: 13.34,15.24 IC1.18
  Bottom 0.152: v12.45,15.24 12.09,15.6 v12.09,17.91
JTAGTMS  (via drill 0.35)
  Top 0.152: v3.17,18.4 4.33,17.25 5.87,17.25 12.96,10.16 13.34,10.16
  Top 0.813: IC1.22 13.34,10.16
  Bottom 0.152: J1.2 v3.17,18.4
LTC_CRS
  Top 0.406: C8.2 R22.2
LTC_FB
  Top 0.305: LTC.9 20.21,64.76
  Top 0.406: R21.2 R19.1 27.18,64.76 | R22.1 27.47,65.05 27.18,64.76 | 20.21,64.76 27.18,64.76
LTC_IND1
  Top 0.406: D2.C 13.7,68.55 13.7,64.36 13.82,64.25 LTC.3
  pour Top: 13.79,64.17 4.27,64.17 4.27,69.28 13.79,69.28
LTC_IND2  (via drill 0.35)
  Top 0.152: 13.04,63.63 13.04,62.53 13.01,62.5 8.8,62.5 L2.2
  Top 0.254: LTC.4 17.3,63.74 v17.68,64.12 | v21.46,66.33 22.95,66.33 D7.A
  Top 0.305: LTC.4 13.16,63.74 13.04,63.63
  Bottom 0.254: v17.68,64.12 19.89,66.33 v21.46,66.33
  pour Top: 13.09,63.61 4.33,63.61 4.33,60.57 12.59,60.57 13.09,61.07
  pour Top: 15.51,63.87 12.71,63.87 12.71,63.67 15.51,63.67
LTC_RT
  Top 0.305: LTC.1 14.97,65.52 16.03,66.58 R18.1
LTC_VC
  Top 0.305: LTC.10 19.34,65.39
  Top 0.406: 19.34,65.39 19.34,66.75 C8.1
MAX_AIN1
  Top 0.254: R3.1 R4.2 14.88,31.5 22.86,31.5 24.26,32.89 24.26,33.53 23.66,34.12 MAX.9
MAX_CSP  (via drill 0.35)
  Top 0.254: MAX.2 18.52,35.73 v18.24,36.01 | v17.4,34.18 16,32.78 R5.2
  Bottom 0.254: v18.24,36.01 17.4,35.17 v17.4,34.18
MAX_INT  (via drill 0.35)
  Top 0.254: D6.C 29.84,38.24 R20.1 31,36.56 32,35.56 32,33.66 v31.24,32.89 | MAX.8 23.11,32.94 v23.11,32.89
  Bottom 0.254: v31.24,32.89 v23.11,32.89
MAX_REG2  (via drill 0.35)
  Top 0.254: v18.03,37.59 19.05,38.61 C13.1 | MAX.3 17.41,35.33 v17,35.73
  Bottom 0.254: v18.03,37.59 17.91,37.59 17,36.69 v17,35.73
MAX_SCL
  Top 0.254: D5.C R2.1 26.54,35.56 24.64,35.56 24,34.92 MAX.11
MAX_SDA
  Top 0.254: D4.C R23.1 24.37,36.56 23.14,35.33 22.33,35.33 MAX.12
MAX_THRM  (via drill 0.35)
  Top 0.254: R3.2 18.03,29.97 v18.54,30.48 | v20.8,36.84 22.09,36.84 22.33,36.6 MAX.14
  Bottom 0.254: v18.54,30.48 19.3,31.24 19.3,36.45 19.7,36.84 v20.8,36.84
MAX_VBAT  (via drill 0.35)
  Top 0.152: MAX.5 MAX.6 19.33,33.76 MAX.7
  Top 0.254: R1.2 15.57,37.23 C12.1 16.42,36.68 18.96,36.68 | 18.96,36.68 19.07,36.68 19.07,36.38 MAX.1 | MAX.13 22.87,35.73 23.19,36.04 23.19,36.79 v22.48,37.5 19.78,37.5 18.96,36.68 | v18.43,34.12 18.8,33.76 19.33,33.76
  Bottom 0.254: v22.48,37.5 19.78,37.5 18.9,36.62 18.9,34.67 18.43,34.2 v18.43,34.12
MPC_LED
  Top 0.406: R17.2 D3.C
MPC_RPROG
  Top 0.406: MCP.5 22.21,50.85 R16.2
MPC_STAT
  Top 0.406: MCP.1 19.62,50.84 R17.1
N$1
  Top 0.406: JP4.1 JP4.3 JP4.5 5.65,8.19 R6.2
N$2
  Top 0.305: U1.6 55.33,57.06 R9.2
N$4  (via drill 0.35)
  Top 0.152: U1.13 v54.04,63.5
  Bottom 0.152: v54.04,63.5 54.04,62.83 51.5,60.3 R14.2
N$9
  Top 0.813: IC1.45 34.8,5.08
N$10
  Top 0.813: IC1.25 13.34,6.35
N$11
  Top 0.813: IC1.26 13.34,5.08
N$14
  Top 0.813: IC1.17 13.34,16.51
N$15
  Top 0.813: IC1.15 15.88,19.43
N$16
  Top 0.813: IC1.14 17.14,19.43
N$17
  Top 0.813: IC1.13 18.41,19.43
N$18
  Top 0.813: IC1.20 13.34,12.7
NRESET  (via drill 0.35)
  Top 0.152: Q1.1 50.16,4.83 48.39,3.05 SW1.1 31.08,3.05 30.2,3.94 24.51,3.94 23.43,2.86 | J1.10 1.91,28.84 1.14,28.08 1.14,21.92 4.29,18.77 5.74,18.77 12.18,12.33 v12.18,11.89 | IC1.35 23.5,2.79 23.43,2.86 | 23.43,2.86 23.11,3.17 17.16,3.17 16.74,3.59 v16.74,5.08
  Bottom 0.152: v16.74,5.08 12.18,9.64 v12.18,11.89
RDX  (via drill 0.35)
  Top 0.152: v32.54,28.54 32.54,22 31.62,21.08 30.23,21.08 28.57,19.43
  Top 0.813: IC1.5 28.57,19.43
  Bottom 0.152: v32.54,28.54 v32.54,28.55 33.13,29.15 56.83,29.15 JP2.11
RESET_DIODE
  Top 0.152: D1.C R8.2
RESET_MOS
  Top 0.152: R8.1 Q1.3
RESET_SW1
  Top 0.152: R7.2 52.71,3.93 SW1.2
SDCLK  (via drill 0.35)
  Top 0.152: 26.04,19.43 26.04,20.57 v26.54,21.08
  Top 0.813: IC1.7 26.04,19.43
  Bottom 0.152: JP2.8 57.58,22.28 27.74,22.28 v26.54,21.08
SDCMD  (via drill 0.35)
  Top 0.152: 24.77,19.43 24.77,20.09 v25.15,20.48
  Top 0.813: IC1.8 24.77,19.43
  Bottom 0.152: JP2.7 58.32,20.48 v25.15,20.48
SDDAT0  (via drill 0.35 pad 0.55)
  Top 0.152: 27.3,19.43 27.3,22.07 28.12,22.88 v28.7,22.88
  Top 0.813: IC1.6 27.3,19.43
  Bottom 0.152: JP2.9 55.65,22.88 v28.7,22.88
SOP0  (via drill 0.35)
  Top 0.152: IC1.34 22.18,2.11 21.42,2.87 16.17,2.87 15.75,3.29 v15.75,4.06 | v12.27,7.06 8.79,10.54 JP4.6
  Bottom 0.152: v15.75,4.06 15.27,4.06 v12.27,7.06
SOP1
  Top 0.152: JP4.4 7.87,13.08 13.34,7.62
  Top 0.813: IC1.24 13.34,7.62
SOP2
  Top 0.152: JP4.2 6.6,15.62 13.34,8.89
  Top 0.813: 13.34,8.89 IC1.23
UART0RX  (via drill 0.35)
  Top 0.152: v10.9,22.28 9.92,23.25 9.89,23.25 9.86,23.29 9.86,29.01 JP1.2 | IC1.47 33.63,7.62 30.8,4.79 v18.81,4.79
  Top 0.813: IC1.47 34.8,7.62
  Bottom 0.152: v10.9,22.28 10.92,22.28 15.79,17.41 15.79,7.8 v18.81,4.79
UART0TX  (via drill 0.35)
  Top 0.152: v10.97,21.13 9.4,22.71 9.4,26.92 JP1.1 | v31.45,4.2 33.6,6.35 IC1.46
  Top 0.813: IC1.46 34.8,6.35
  Bottom 0.152: v10.97,21.13 15.47,16.64 15.47,7.26 18.59,4.14 31.39,4.14 v31.45,4.2
VBAT  (via drill 0.35, 0.5)
  Top 0.406: C10.1 21.35,63.74 20.2,63.74 20.19,63.75 19.34,63.75 LTC.8 | 21.55,62.05 C10.1 | v19.68,44.58 21.08,43.18 v27.05,43.18 | v14.35,44.58 11.71,44.58 J5.1 9.19,39.23 R1.1 | C10.1 21.64,62.05 v29.97,53.72
  Bottom 0.406: v29.97,53.72 29.97,45.73 27.42,43.18 v27.05,43.18
  other vias: 19.68,45.72 17.91,46.35 17.78,44.58 16.13,45.47 16.13,44.45 14.22,46.48
  pour Top: 18.81,63.87 22.24,63.87 22.24,62.34 20.46,62.34 20.46,63.61 18.81,63.61
  pour Top: 20.7,47.24 20.7,43.94 13.72,43.94 13.72,47.24
  pour Bottom: 13.72,47.24 20.7,47.24 20.7,43.94 13.72,43.94
VBUS  (via drill 0.35, 0.5)
  Top 0.406: J4.VBUS1 10.88,53.12 12.32,51.69 v12.32,49.53 11.01,48.22 J4.VBUS2 | C9.1 28.14,46.69 28.92,47.46 28.92,51.85 27.84,52.93 D3.A
  Bottom 0.406: v12.32,49.53 12.32,44.06 13.72,42.66 22.97,42.66 v24.77,44.45
  other vias: 26.8,45.47 26.8,44.45 24.89,45.47 22.35,45.59 22.35,44.45
  pour Top: 21.59,47.24 21.59,43.94 27.43,43.94 27.43,47.12 27.43,47.24
  pour Bottom: 21.59,47.24 21.59,43.94 27.43,43.94 27.43,47.24
VCC  (via drill 0.35, 0.35 pad 0.55, 0.5)
  Top 0.152: 40.29,8.87 D1.A | v31.83,26.57 31.34,26.08 74LVC.8
  Top 0.203: U$2.2 v46.35,72.5 | v44.35,72.5 U$2.6 | U$2.10 v42.35,72.5
  Top 0.254: IC1.40 v29.84,3.3 | LTC.6 19.36,63.25 19.36,62.75 19.46,62.65 19.76,62.65 19.82,62.59 v19.82,61.2
  Top 0.305: U$2.14 40.35,72.43 v40.26,72.52
  Top 0.406: IC1.37 v26.04,3.3 | v40.28,5.66 40.29,8.87 | D1.A 40.27,10.13 | 40.27,10.13 40.26,10.79 40.26,11.94 v40.26,26.54 | 40.27,10.13 42.34,12.03 v48.41,12.03 | R19.2 23.52,62.33 v24.78,61.07 26.59,61.07 v40.26,47.41 v40.26,28.2 | R6.1 6.35,6.22 7.72,4.85 v7.75,4.85 | R10.1 7.14,21.37 9.82,18.69 v11.33,18.69 11.43,18.69 18.14,25.4 R12.1 R11.1 21.57,23.2 R13.1 | v41.67,48.82 50.19,57.34 C24.1 53.43,57.34 | v26.02,65.71 25.41,66.32 D7.C | 53.43,57.34 53.44,57.34 54.7,58.6 U1.5 | 53.43,57.34 53.43,57.06 54.55,55.94 R9.1 C23.1 | v19.82,61.2 19.29,61.2 19.04,60.95 C11.1
  Bottom 0.152: v40.26,26.54 40.23,26.57 v31.83,26.57
  Bottom 0.406: C3.1 C2.1 8.98,3.62 v7.75,4.85 | v19.82,61.2 19.95,61.07 v24.78,61.07 24.78,64.47 v26.02,65.71 33.54,65.71 40.27,72.44 40.27,72.5 v40.26,72.52 42.34,72.52 v42.35,72.5 v44.35,72.5 v46.35,72.5 | v40.28,5.66 37.92,3.3 v29.84,3.3 v26.04,3.3 11.43,3.3 C3.1 | JP2.6 59.63,20.32 51.33,12.03 v48.41,12.03 | C3.1 11.33,3.72 v11.33,18.69 | v41.67,48.82 v40.26,47.41 | v40.26,26.54 v40.26,28.2
  pour Top: 19.82,63.11 17.67,63.11 17.67,59.3 19.82,59.3
VIN1
  Top 0.152: U1.7 55.99,59.07 56.39,58.67 57.15,58.67 59.56,61.09 TP9.TP
  Top 0.203: U1.7 55.99,60.78 54.79,61.99 48.97,61.99 39.84,71.12 U$2.15
VIN2
  Top 0.152: U1.10 55.99,64.66 56.26,64.39 60.83,64.39 TP11.TP
  Top 0.203: U1.10 55.99,66.06 54.29,67.76 47.2,67.76 43.84,71.12 U$2.7
VIN3
  Top 0.152: 55.91,61.77 57.2,61.77 58.55,63.12 TP10.TP
  Top 0.203: U1.8 56.66,61.02 55.91,61.77 55.33,62.34 50.5,62.34 41.87,70.98 41.87,71.45 U$2.11
VIN4
  Top 0.152: U1.9 59.85,65.44 TP12.TP
  Top 0.203: U1.9 56.66,66.06 54.51,68.2 48.91,68.2 48.9,68.19 48.38,68.19 45.84,70.72 U$2.3
WRX
  Top 0.152: JP2.10 57.4,27.18 39.88,27.18 39.5,26.8 39.5,7.37 35.94,3.81 34.8,3.81
  Top 0.813: IC1.44 34.8,3.81

### Text on the board
tPlace: I2C | LTC3440 | SCL | 4 | 2 | 3 | 1 | MCP73831 | USBC | D7-D4 | MAX17201 | BATT | D3-D0 | UART | JTAG | DCRTL | SD | + | SOP | I2C | - | Reset | CC3220
bPlace: ADC
tNames: D1